# Altium schematic sheet TPS65988.SchDoc
size A2; SheetNumber: 3; SheetTotal: 8
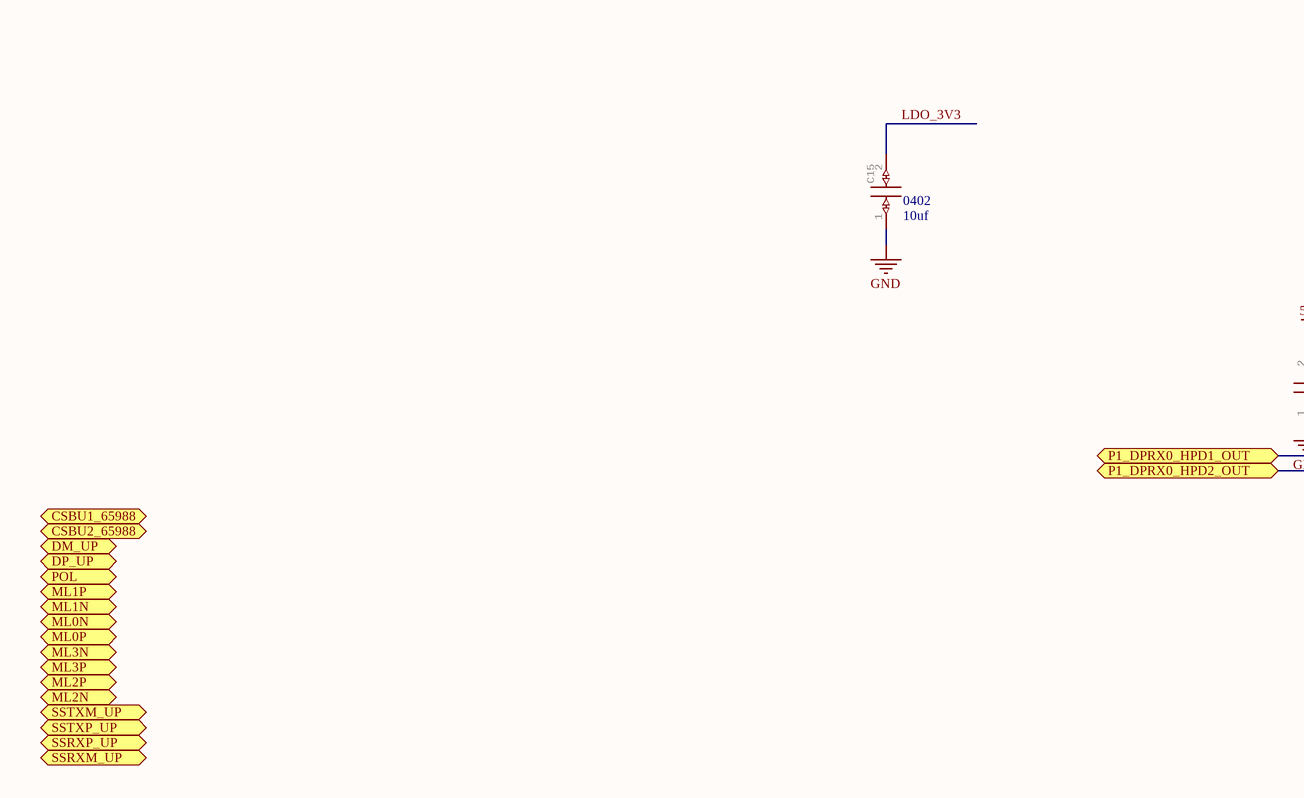
[diagram p0: TPS65988.SchDoc, left]
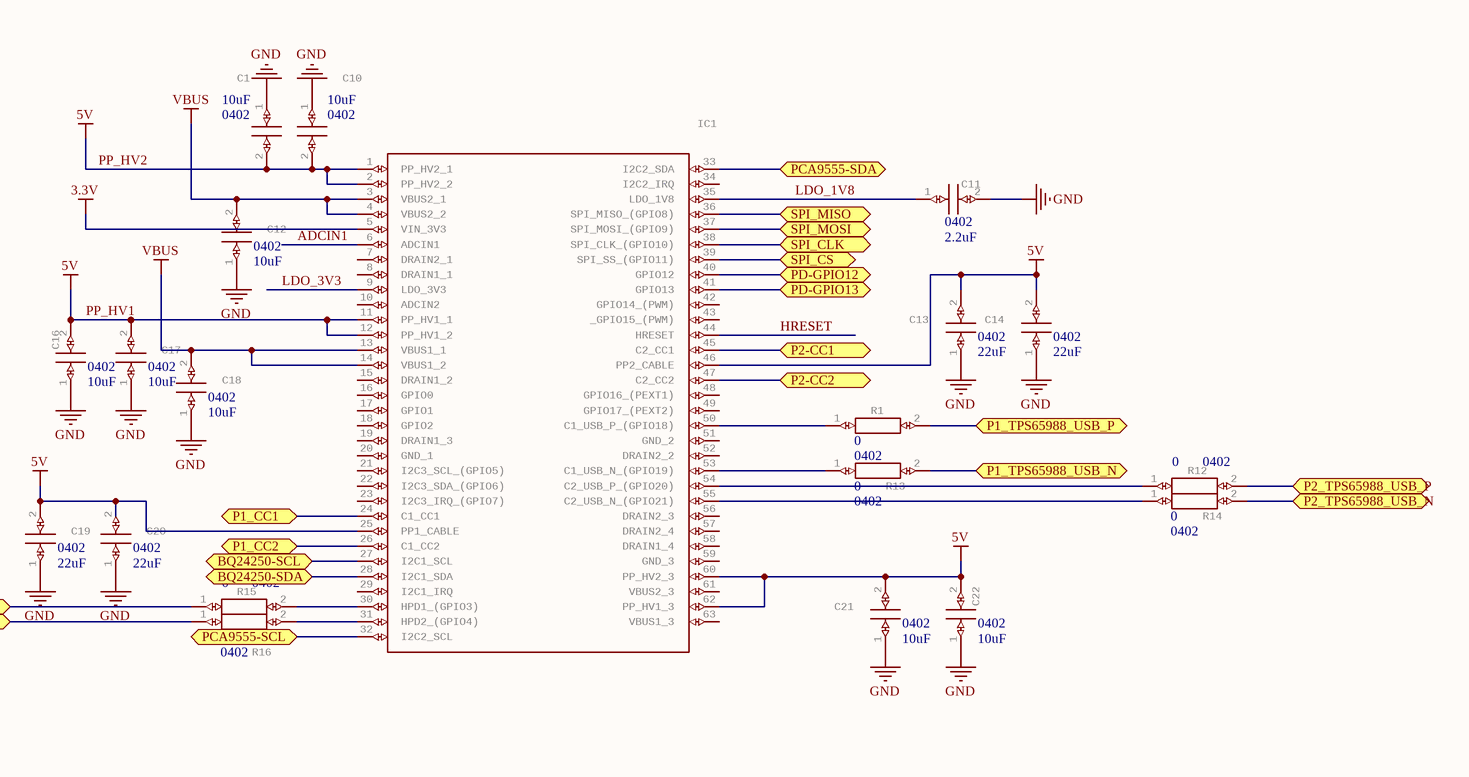
[diagram p1: TPS65988.SchDoc, right]

## Parts
C1  value 10uF  Package: 0402  [CAPC1005X56N]  (hidden comment: Multilayer Ceramic Capacitors MLCC - SMD/SMT 50V .1uF X7R 0402 10% Tol   Source:  Datasheet)
C10  value 10uF  Package: 0402  [CAPC1005X56N]  (hidden comment: Multilayer Ceramic Capacitors MLCC - SMD/SMT 50V .1uF X7R 0402 10% Tol   Source:  Datasheet)
C11  value 2.2uF  Package: 0402  [CAPC1005X56N]  (hidden comment: Multilayer Ceramic Capacitors MLCC - SMD/SMT 50V .1uF X7R 0402 10% Tol   Source:  Datasheet)
C12  value 10uF  Package: 0402  [CAPC1005X56N]  (hidden comment: Multilayer Ceramic Capacitors MLCC - SMD/SMT 50V .1uF X7R 0402 10% Tol   Source:  Datasheet)
C13  value 22uF  Package: 0402  [CAPC1005X56N]  (hidden comment: Multilayer Ceramic Capacitors MLCC - SMD/SMT 50V .1uF X7R 0402 10% Tol   Source:  Datasheet)
C14  value 22uF  Package: 0402  [CAPC1005X56N]  (hidden comment: Multilayer Ceramic Capacitors MLCC - SMD/SMT 50V .1uF X7R 0402 10% Tol   Source:  Datasheet)
C15  value 10uf  Package: 0402  [CAPC1005X56N]  (hidden comment: Multilayer Ceramic Capacitors MLCC - SMD/SMT 50V .1uF X7R 0402 10% Tol   Source:  Datasheet)
C16  value 10uF  Package: 0402  [CAPC1005X56N]  (hidden comment: Multilayer Ceramic Capacitors MLCC - SMD/SMT 50V .1uF X7R 0402 10% Tol   Source:  Datasheet)
C17  value 10uF  Package: 0402  [CAPC1005X56N]  (hidden comment: Multilayer Ceramic Capacitors MLCC - SMD/SMT 50V .1uF X7R 0402 10% Tol   Source:  Datasheet)
C18  value 10uF  Package: 0402  [CAPC1005X56N]  (hidden comment: Multilayer Ceramic Capacitors MLCC - SMD/SMT 50V .1uF X7R 0402 10% Tol   Source:  Datasheet)
C19  value 22uF  Package: 0402  [CAPC1005X56N]  (hidden comment: Multilayer Ceramic Capacitors MLCC - SMD/SMT 50V .1uF X7R 0402 10% Tol   Source:  Datasheet)
C20  value 22uF  Package: 0402  [CAPC1005X56N]  (hidden comment: Multilayer Ceramic Capacitors MLCC - SMD/SMT 50V .1uF X7R 0402 10% Tol   Source:  Datasheet)
C21  value 10uF  Package: 0402  [CAPC1005X56N]  (hidden comment: Multilayer Ceramic Capacitors MLCC - SMD/SMT 50V .1uF X7R 0402 10% Tol   Source:  Datasheet)
C22  value 10uF  Package: 0402  [CAPC1005X56N]  (hidden comment: Multilayer Ceramic Capacitors MLCC - SMD/SMT 50V .1uF X7R 0402 10% Tol   Source:  Datasheet)
IC1  Dual port USB Type-C and PD Controller with integrated power switches for PC & Thunderbolt systems   Source:  Datasheet  [TPS65988DJRSHR]  (value not drawn)
R1  value 0  Package: 0402  [RESC1005X40N]  (hidden comment: GENERAL PURPOSE CHIP RESISTORS   Source:  Datasheet)
R12  value 0  Package: 0402  [RESC1005X40N]  (hidden comment: GENERAL PURPOSE CHIP RESISTORS   Source:  Datasheet)
R13  value 0  Package: 0402  [RESC1005X40N]  (hidden comment: GENERAL PURPOSE CHIP RESISTORS   Source:  Datasheet)
R14  value 0  Package: 0402  [RESC1005X40N]  (hidden comment: GENERAL PURPOSE CHIP RESISTORS   Source:  Datasheet)
R15  value 0  Package: 0402  [RESC1005X40N]  (hidden comment: GENERAL PURPOSE CHIP RESISTORS   Source:  Datasheet)
R16  value 0  Package: 0402  [RESC1005X40N]  (hidden comment: GENERAL PURPOSE CHIP RESISTORS   Source:  Datasheet)

## Ports
BQ24250-SCL (bidir), BQ24250-SDA (bidir), CSBU1_65988 (bidir), CSBU2_65988 (bidir), DM_UP (bidir), DP_UP (bidir), ML0N (bidir), ML0P (bidir), ML1N (bidir), ML1P (bidir), ML2N (bidir), ML2P (bidir), ML3N (bidir), ML3P (bidir), P1_CC1 (bidir), P1_CC2 (bidir), P1_DPRX0_HPD1_OUT (bidir), P1_DPRX0_HPD2_OUT (bidir), P1_TPS65988_USB_N (bidir), P1_TPS65988_USB_P (bidir), P2-CC1 (bidir), P2-CC2 (bidir), P2_TPS65988_USB_N (bidir), P2_TPS65988_USB_P (bidir), PCA9555-SCL (bidir), PCA9555-SDA (bidir), PD-GPIO12 (bidir), PD-GPIO13 (bidir), POL (bidir), SPI_CLK (bidir), SPI_CS (bidir), SPI_MISO (bidir), SPI_MOSI (bidir), SSRXM_UP (bidir), SSRXP_UP (bidir), SSTXM_UP (bidir), SSTXP_UP (bidir)

## Nets
3.3V: IC1.5(VIN_3V3)
GND: C1.1 C10.1 C11.2 C12.1 C13.1 C14.1 C15.1 C16.1 C17.1 C18.1 C19.1 C20.1 C21.1 C22.1
PP_HV1: C1.2 C10.2 C13.2 C14.2 C16.2 C17.2 C19.2 C20.2 C21.2 C22.2 IC1.1(PP_HV2_1) IC1.2(PP_HV2_2) IC1.11(PP_HV1_1) IC1.12(PP_HV1_2) IC1.25(PP1_CABLE) IC1.46(PP2_CABLE) IC1.60(PP_HV2_3) IC1.62(PP_HV1_3)  [also labelled 5V, PP_HV2]
VBUS: C12.2 C18.2 IC1.3(VBUS2_1) IC1.4(VBUS2_2) IC1.13(VBUS1_1) IC1.14(VBUS1_2)
ADCIN1: IC1.6(ADCIN1)
BQ24250-SCL: IC1.27(I2C1_SCL) ; port BQ24250-SCL
BQ24250-SDA: IC1.28(I2C1_SDA) ; port BQ24250-SDA
HRESET: IC1.44(HRESET)
LDO_1V8: C11.1 IC1.35(LDO_1V8)
LDO_3V3: C15.2 IC1.9(LDO_3V3)
P1_CC1: IC1.24(C1_CC1) ; port P1_CC1
P1_CC2: IC1.26(C1_CC2) ; port P1_CC2
P1_DPRX0_HPD1_OUT: R15.1 ; port P1_DPRX0_HPD1_OUT
P1_DPRX0_HPD2_OUT: R16.1 ; port P1_DPRX0_HPD2_OUT
P1_TPS65988_USB_N: R13.2 ; port P1_TPS65988_USB_N
P1_TPS65988_USB_P: R1.2 ; port P1_TPS65988_USB_P
P2-CC1: IC1.45(C2_CC1) ; port P2-CC1
P2-CC2: IC1.47(C2_CC2) ; port P2-CC2
P2_TPS65988_USB_N: R14.2 ; port P2_TPS65988_USB_N
P2_TPS65988_USB_P: R12.2 ; port P2_TPS65988_USB_P
PCA9555-SCL: IC1.32(I2C2_SCL) ; port PCA9555-SCL
PCA9555-SDA: IC1.33(I2C2_SDA) ; port PCA9555-SDA
PD-GPIO12: IC1.40(GPIO12) ; port PD-GPIO12
PD-GPIO13: IC1.41(GPIO13) ; port PD-GPIO13
SPI_CLK: IC1.38(SPI_CLK_(GPIO10)) ; port SPI_CLK
SPI_CS: IC1.39(SPI_SS_(GPIO11)) ; port SPI_CS
SPI_MISO: IC1.36(SPI_MISO_(GPIO8)) ; port SPI_MISO
SPI_MOSI: IC1.37(SPI_MOSI_(GPIO9)) ; port SPI_MOSI
NetIC1_30: IC1.30(HPD1_(GPIO3)) R15.2
NetIC1_31: IC1.31(HPD2_(GPIO4)) R16.2
NetIC1_50: IC1.50(C1_USB_P_(GPIO18)) R1.1
NetIC1_53: IC1.53(C1_USB_N_(GPIO19)) R13.1
NetIC1_54: IC1.54(C2_USB_P_(GPIO20)) R12.1
NetIC1_55: IC1.55(C2_USB_N_(GPIO21)) R14.1

Not connected (* = marked no-connect by the designer): IC1 7(DRAIN2_1) 8(DRAIN1_1) 10(ADCIN2) 15(DRAIN1_2) 16(GPIO0) 17(GPIO1) 18(GPIO2) 19(DRAIN1_3) 20(GND_1) 21(I2C3_SCL_(GPIO5)) 22(I2C3_SDA_(GPIO6)) 23(I2C3_IRQ_(GPIO7)) 29(I2C1_IRQ) 34(I2C2_IRQ) 42(GPIO14_(PWM)) 43(_GPIO15_(PWM)) 48(GPIO16_(PEXT1)) 49(GPIO17_(PEXT2)) 51(GND_2) 52(DRAIN2_2) 56(DRAIN2_3) 57(DRAIN2_4) 58(DRAIN1_4) 59(GND_3) 61(VBUS2_3) 63(VBUS1_3)

## Library data of the parts
C1 C10-C22 = 04025C104KAT2A: Manufacturer_Name: AVX; GateName_1: G$1; SymbolName_1: 04025C104KAT2A; LibraryName: 04025C104KAT2A; DeviceSetName: 04025C104KAT2A; Manufacturer_Part_Number: 04025C104KAT2A; Mouser_Part_Number: 581-04025C104KAT2A; Mouser_Price-Stock: https://www.mouser.co.uk/ProductDetail/AVX/04025C104KAT2A?qs=ZBeOGGPQgEFYcwOskjAIVQ%3D%3D; Arrow_Part_Number: 04025C104KAT2A; Arrow_Price-Stock: https://www.arrow.com/en/products/04025c104kat2a/avx?region=nac; Height: 0.56mm
IC1 = TPS65988DJRSHR: Manufacturer_Name: Texas Instruments; GateName_1: G$1; SymbolName_1: TPS65988DJRSHR; LibraryName: TPS65988DJRSHR; DeviceSetName: TPS65988DJRSHR; Package: TPS65988DJRSHR; Manufacturer_Part_Number: TPS65988DJRSHR; Mouser_Part_Number: 595-TPS65988DJRSHR; Mouser_Price-Stock: https://www.mouser.co.uk/ProductDetail/Texas-Instruments/TPS65988DJRSHR?qs=T3oQrply3y8cml9f5FMm3A%3D%3D; Arrow_Part_Number: TPS65988DJRSHR; Arrow_Price-Stock: https://www.arrow.com/en/products/tps65988djrshr/texas-instruments; Height: 1mm
R1 R12-R16 = RC0402FR-071KL: Manufacturer_Name: KEMET; GateName_1: G$1; SymbolName_1: RC0402FR-071KL; LibraryName: RC0402FR-071KL; DeviceSetName: RC0402FR-071KL; Manufacturer_Part_Number: RC0402FR-071KL; Mouser_Part_Number: 603-RC0402FR-071KL; Mouser_Price-Stock: https://www.mouser.co.uk/ProductDetail/YAGEO/RC0402FR-071KL?qs=V1yeUXFNrknDEmWLmm5v6g%3D%3D; Arrow_Part_Number: RC0402FR-071KL; Arrow_Price-Stock: https://www.arrow.com/en/products/rc0402fr-071kl/yageo?region=nac; Height: 0.4mm